# EAGLE design Seeeduino-stalker (EAGLE 5.10)
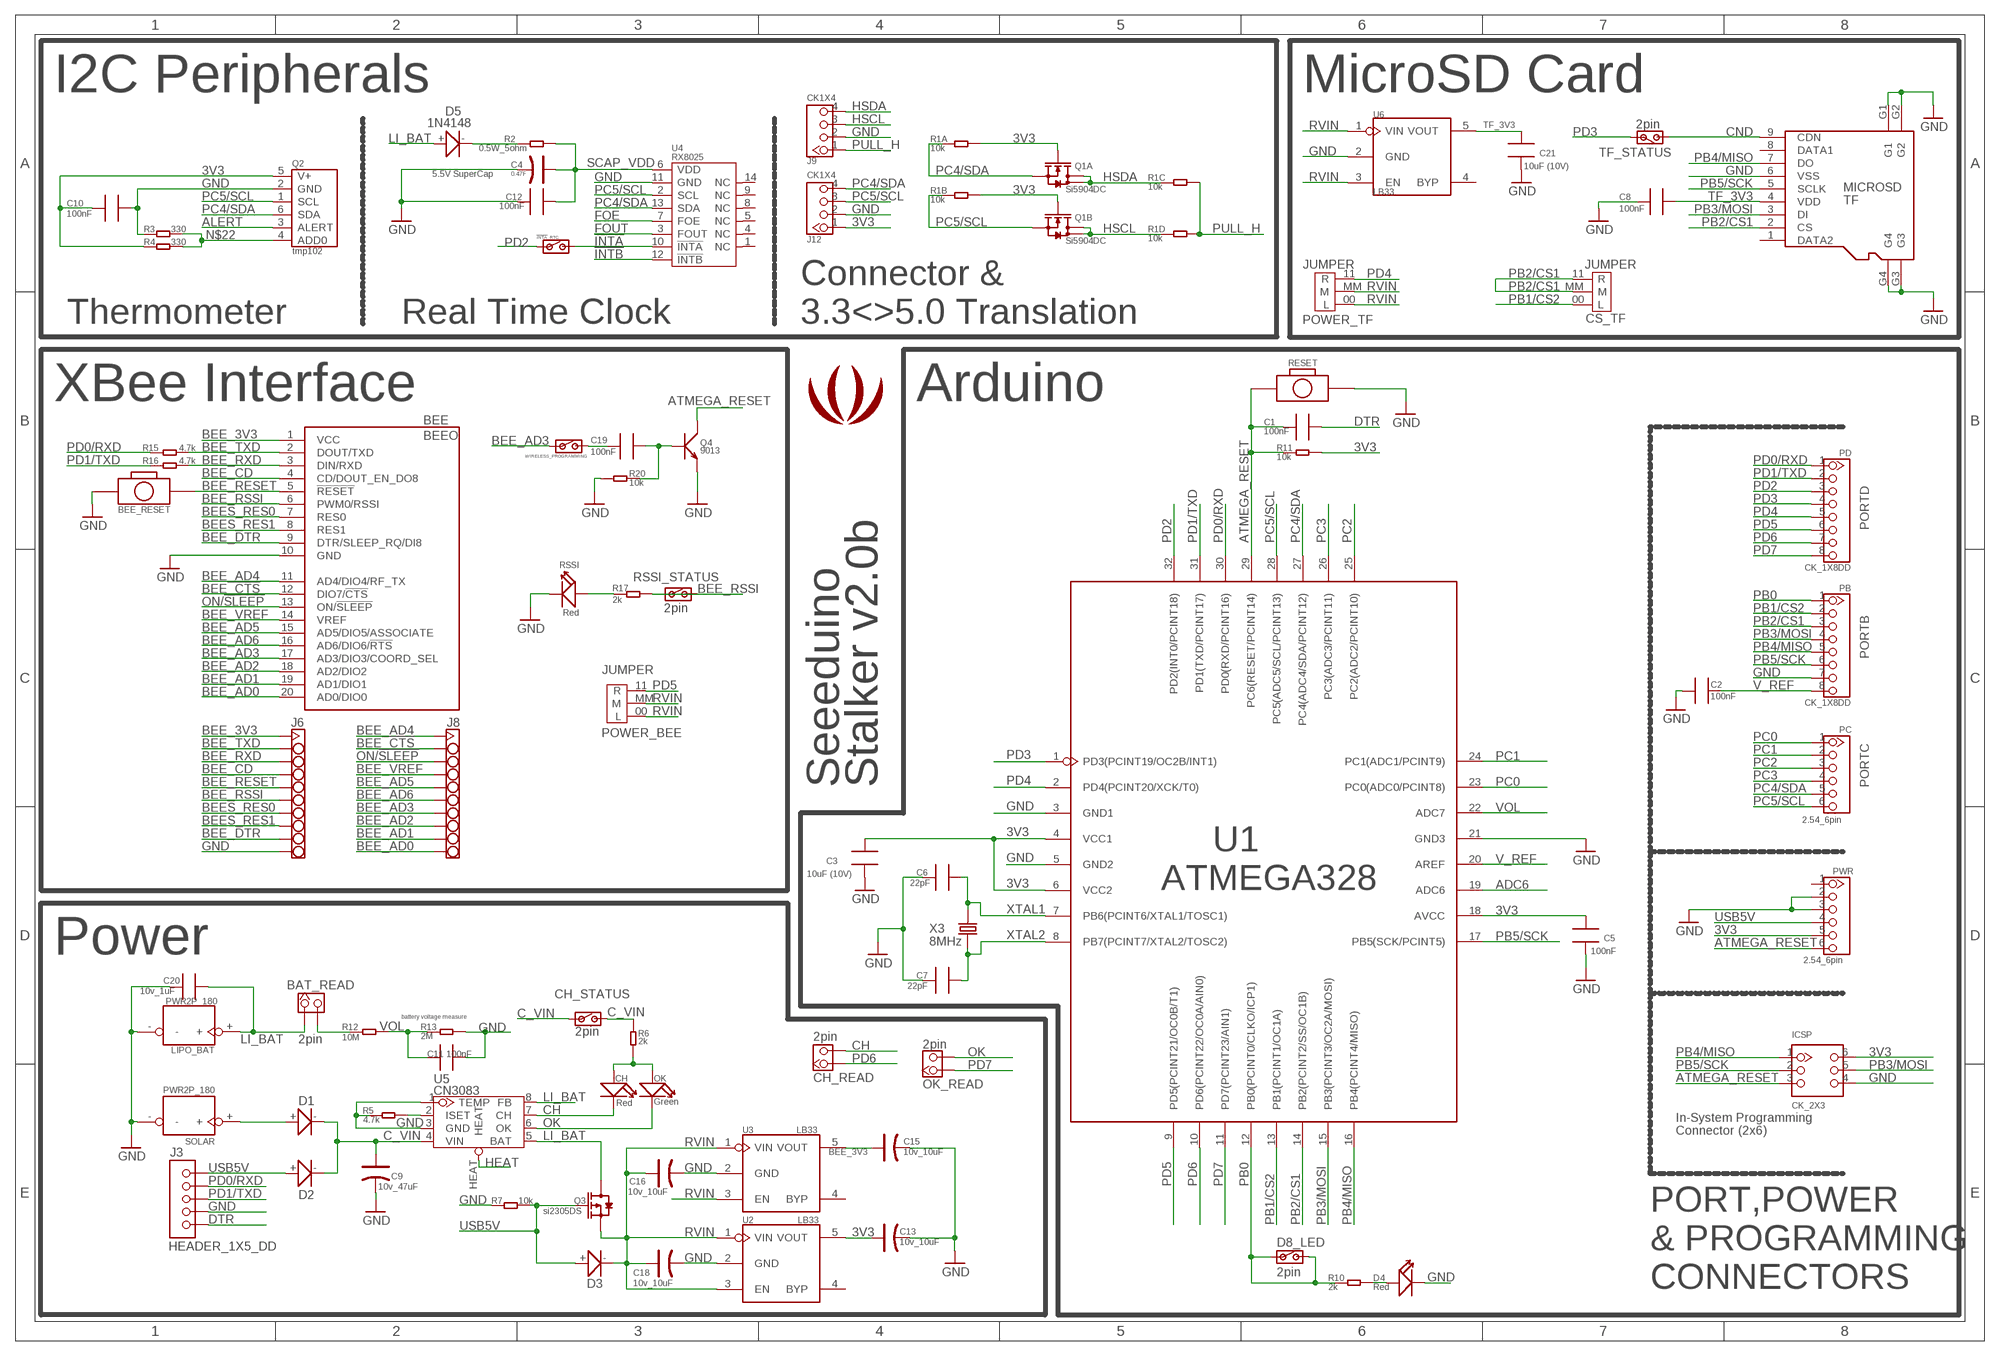
[diagram p0: schematic, sheet 1]

## Parts
!INTA!_RTC  JP_SW  [JP_SW]
BAT_READ  2pin  HEADER_1X2_2.54  [CK_1*2]
BEE  BEEO  [BEE]
BEE_RESET  BOTTON_1_SMD  [BOTTON_1]
C1  100nF  006-C0603  [0603]
C2  100nF  006-C0603  [0603]
C3  10uF (10V)  006-C0805  [0805]
C4  0.47F  006-CAP_UC13  [SUPER_CAP_R13]
C5  100nF  006-C0603  [0603]
C6  22pF  006-C0603  [0603]
C7  22pF  006-C0603  [0603]
C8  100nF  006-C0603  [0603]
C9  10v_47uF  006-CAP_AVX_B  [AVX_B]
C10  100nF  006-C0603  [0603]
C11  100nF  006-C0603  [0603]
C12  100nF  006-C0603  [0603]
C13  10v_10uF  006-CAP_AVX_B  [AVX_B]
C15  10v_10uF  006-CAP_AVX_B  [AVX_B]
C16  10v_10uF  006-CAP_AVX_B  [AVX_B]
C18  10v_10uF  006-CAP_AVX_B  [AVX_B]
C19  100nF  006-C0603  [0603]
C20  10v_1uF  006-C0805  [0805]
C21  10uF (10V)  006-C0805  [0805]
CH  Red  007-LED0603  [D0603]
CH_READ  2pin  HEADER_1X2_2.54  [CK_1*2]
CH_STATUS  2pin  JP_SW  [JP_SW]
CS_TF  JUMPER  [JUMPER]
D1  010-DMSS1P2U  [D1005]
D2  010-DMSS1P2U  [D1005]
D3  010-DMSS1P2U  [D1005]
D4  Red  007-LED0603  [D0603]
D5  1N4148  010-D1206  [D1206]
D8_LED  2pin  JP_SW  [JP_SW]
ICSP  CK_2X3  CK_2X3_DD  [CK_2X3]
J3  HEADER_1X5_DD  [CK_1X5]
J6  NULL  HEADER_1X10DD  [HEADER_1X10]
J8  null  HEADER_1X10DD  [HEADER_1X10]
J9  CK1X4  CK_1X4_DD  [CK_1X4]
J12  CK1X4  CK_1X4_DD  [CK_1X4]
LIPO_BAT  PWR2P_180  [PWR_1X2]
LOGO1  LOGO  [LOGO_RO]
OK  Green  007-LED0603  [D0603]
OK_READ  2pin  HEADER_1X2_2.54  [CK_1*2]
PB  CK_1X8DD  [CK_1X8]
PC  2.54_6pin  HEADER_1X6  [CK_1X6]
PD  CK_1X8DD  [CK_1X8]
POWER_BEE  JUMPER  [JUMPER]
POWER_TF  JUMPER  [JUMPER]
PWR  2.54_6pin  HEADER_1X6  [CK_1X6]
Q1  Si5904DC  010-DUAL-N-MOSFET_1206-8  [1206-8]
Q2  tmp102  TMP102  [SOT563]
Q3  si2305DS  010-P-MOSFETSOT23  [SOT23]
Q4  9013  010-NPNSOT23  [SOT23]
R1  10k  005-4R_1206  [R1206-8]
R2  0.5W_5ohm  005-R1206  [1206]
R3  330  005-R0603  [0603]
R4  330  005-R0603  [0603]
R5  4.7k  005-R0603  [0603]
R6  2k  005-R0603  [0603]
R7  10k  005-R0603  [0603]
R10  2k  005-R0603  [0603]
R11  10k  005-R0603  [0603]
R12  10M  005-R0603  [0603]
R13  2M  005-R0603  [0603]
R15  4.7k  005-R0603  [0603]
R16  4.7k  005-R0603  [0603]
R17  2k  005-R0603  [0603]
R20  10k  005-R0603  [0603]
RESET  BOTTON_1_DP  [BTN_5.0_RST]
RSSI  Red  007-LED0603  [D0603]
RSSI_STATUS  2pin  JP_SW  [JP_SW]
SOLAR  PWR2P_180  [PWR_1X2]
TF  MICROSD  [MICROSD]
TF_STATUS  2pin  JP_SW  [JP_SW]
U1  ATMEGA328  ATMEGA168-20AU  [ATMEGA168-20AU]
U2  LB33  MIC5025_X.X  [SOT23-5]
U3  LB33  MIC5025_X.X  [SOT23-5]
U4  RX8025  [SOP14]
U5  CN3083  [SOP8]
U6  LB33  MIC5025_X.X  [SOT23-5]
WIRELESS_PROGRAMMING  JP_SW  [JP_SW]
X3  8MHz  011-CRYSTALHC49S  [HC49/S]

## Nets
3V3: C3.2 C5.1 C10.1 C13.+ ICSP.6 J12.1 PWR.5 Q1.2(A:G) Q1.4(B:G) Q2.5(V+) R1.7 R1.8 R4.1 R11.2 U1.4(VCC1) U1.6(VCC2) U1.18(AVCC) U2.5(VOUT)
!INTA: !INTA!_RTC.2 U4.10(!INTA)
!INTB: U4.12(!INTB)
ADC6: U1.19(ADC6)
ALERT: Q2.3(ALERT)
ATMEGA_RESET: C1.1 ICSP.3 PWR.6 Q4.3(C) R11.1 RESET.P$1 U1.29(PC6(RESET/PCINT14))
BEE_3V3: BEE.1(VCC) C15.+ J6.1 U3.5(VOUT)
BEE_!CTS: BEE.12(DIO7/!CTS) J8.2
BEE_AD0: BEE.20(AD0/DIO0) J8.10
BEE_AD1: BEE.19(AD1/DIO1) J8.9
BEE_AD2: BEE.18(AD2/DIO2) J8.8
BEE_AD3: BEE.17(AD3/DIO3/COORD_SEL) J8.7 WIRELESS_PROGRAMMING.1
BEE_AD4: BEE.11(AD4/DIO4/RF_TX) J8.1
BEE_AD5: BEE.15(AD5/DIO5/ASSOCIATE) J8.5
BEE_AD6: BEE.16(AD6/DIO6/!RTS) J8.6
BEE_CD: BEE.4(CD/DOUT_EN_DO8) J6.4
BEE_DTR: BEE.9(DTR/SLEEP_RQ/DI8) J6.9
BEE_RESET: BEE.5(!RESET) BEE_RESET.P$2 J6.5
BEE_RSSI: BEE.6(PWM0/RSSI) J6.6 R17.2 RSSI_STATUS.1 RSSI_STATUS.2
BEE_RXD: BEE.3(DIN/RXD) J6.3 R16.2
BEE_TXD: BEE.2(DOUT/TXD) J6.2 R15.2
BEE_VREF: BEE.14(VREF) J8.4
BEES_RES0: BEE.7(RES0) J6.7
BEES_RES1: BEE.8(RES1) J6.8
C_VIN: C9.+ CH_STATUS.1 CH_STATUS.2 D1.- D2.- R6.2 U5.4(VIN)
CH: CH.- CH_READ.2 U5.7(CH)
CND: TF.9(CDN) TF_STATUS.2
DTR: C1.2 J3.5
FOE: U4.7(FOE)
FOUT: U4.3(FOUT)
GND: BEE.10(GND) BEE_RESET.1 C2.1 C3.1 C4.- C5.2 C6.1 C7.1 C8.2 C9.- C10.2 C11.2 C12.1 C13.- C15.- C16.- C18.- C20.1 C21.2 D4.- ICSP.4 J3.4 J6.10 J9.2 J12.2 LIPO_BAT.- PB.7 PWR.2 PWR.3 Q2.2(GND) Q4.2(E) R3.1 R5.1 R7.1 R13.2 R20.1 RESET.P$2 RSSI.- SOLAR.- TF.6(VSS) TF.G1 TF.G2 TF.G3 TF.G4 U1.3(GND1) U1.5(GND2) U1.21(GND3) U2.2(GND) U3.2(GND) U4.11(GND) U5.1(TEMP) U5.3(GND) U6.2(GND)
HEAT: U5.HEAT
HSCL: J9.3 Q1.5(B:D) Q1.6(B:D) R1.4
HSDA: J9.4 Q1.7(A:D) Q1.8(A:D) R1.3
LI_BAT: BAT_READ.1 C20.2 D5.+ LIPO_BAT.+ Q3.3(D) U5.5(BAT) U5.8(FB)
N$1: D4.+ R10.2
N$2: C19.1 WIRELESS_PROGRAMMING.2
N$3: D1.+ SOLAR.+
N$5: R5.2 U5.2(ISET)
N$6: R17.1 RSSI.+
N$8: CH.+ OK.+ R6.1
N$11: D5.- R2.1
N$15: BAT_READ.2 R12.1
N$20: C19.2 Q4.1(B) R20.2
N$22: Q2.4(ADD0) R3.2 R4.2
OK: OK.- OK_READ.2 U5.6(OK)
ON/!SLEEP: BEE.13(ON/!SLEEP) J8.3
PB0: D8_LED.1 D8_LED.2 PB.1 R10.1 U1.12(PB0(PCINT0/CLKO/ICP1))
PB1/CS2: CS_TF.00(L) PB.2 U1.13(PB1(PCINT1/OC1A))
PB2/CS1: CS_TF.11(R) CS_TF.MM(M) PB.3 TF.2(CS) U1.14(PB2(PCINT2/SS/OC1B))
PB3/MOSI: ICSP.5 PB.4 TF.3(DI) U1.15(PB3(PCINT3/OC2A/MOSI))
PB4/MISO: ICSP.1 PB.5 TF.7(DO) U1.16(PB4(PCINT4/MISO))
PB5/SCK: ICSP.2 PB.6 TF.5(SCLK) U1.17(PB5(SCK/PCINT5))
PC0: PC.1 U1.23(PC0(ADC0/PCINT8))
PC1: PC.2 U1.24(PC1(ADC1/PCINT9))
PC2: PC.3 U1.25(PC2(ADC2/PCINT10))
PC3: PC.4 U1.26(PC3(ADC3/PCINT11))
PC4/SDA: J12.4 PC.5 Q1.1(A:S) Q2.6(SDA) R1.1 U1.27(PC4(ADC4/SDA/PCINT12)) U4.13(SDA)
PC5/SCL: J12.3 PC.6 Q1.3(B:S) Q2.1(SCL) R1.2 U1.28(PC5(ADC5/SCL/PCINT13)) U4.2(SCL)
PD0/RXD: J3.2 PD.1 R15.1 U1.30(PD0(RXD/PCINT16))
PD1/TXD: J3.3 PD.2 R16.1 U1.31(PD1(TXD/PCINT17))
PD2: !INTA!_RTC.1 PD.3 U1.32(PD2(INT0/PCINT18))
PD3: PD.4 TF_STATUS.1 U1.1(PD3(PCINT19/OC2B/INT1))
PD4: PD.5 POWER_TF.11(R) U1.2(PD4(PCINT20/XCK/T0))
PD5: PD.6 POWER_BEE.11(R) U1.9(PD5(PCINT21/OC0B/T1))
PD6: CH_READ.1 PD.7 U1.10(PD6(PCINT22/OC0A/AIN0))
PD7: OK_READ.1 PD.8 U1.11(PD7(PCINT23/AIN1))
PULL_H: J9.1 R1.5 R1.6
RVIN: C16.+ C18.+ D3.- POWER_BEE.00(L) POWER_BEE.MM(M) POWER_TF.00(L) POWER_TF.MM(M) Q3.2(S) U2.1(VIN) U2.3(EN) U3.1(VIN) U3.3(EN) U6.1(VIN) U6.3(EN)
SCAP_VDD: C4.+ C12.2 R2.2 U4.6(VDD)
TF_3V3: C8.1 C21.1 TF.4(VDD) U6.5(VOUT)
USB5V: D2.+ D3.+ J3.1 PWR.4 Q3.1(G) R7.2
V_REF: C2.2 PB.8 U1.20(AREF)
VOL: C11.1 R12.2 R13.1 U1.22(ADC7)
XTAL1: C6.2 U1.7(PB6(PCINT6/XTAL1/TOSC1)) X3.2
XTAL2: C7.2 U1.8(PB7(PCINT7/XTAL2/TOSC2)) X3.1
Unconnected: PWR.1 TF.1(DATA2) TF.8(DATA1) U2.4(BYP) U3.4(BYP) U4.1(NC) U4.4(NC) U4.5(NC) U4.8(NC) U4.9(NC) U4.14(NC) U6.4(BYP)

## Notes on the sheet
- I2C Peripherals | MicroSD Card
- 5.5V SuperCap
- Connector &
- Thermometer | Real Time Clock | 3.3<>5.0 Translation
- XBee Interface | Arduino
- PORTD
- PORTB
- Seeeduino | Stalker v2.0b | PORTC
- Power
- battery voltage measure
- In-System Programming
- Connector (2x6)
- PORT,POWER
- & PROGRAMMING
- CONNECTORS

## Library data of the parts
!INTA!_RTC CH_STATUS D8_LED RSSI_STATUS TF_STATUS WIRELESS_PROGRAMMING = CPT_SMD:JP_SW
BAT_READ CH_READ OK_READ = CONNECTER:HEADER_1X2
BEE = EXT_moudle:BEE
BEE_RESET RESET = CPT_SMD:BOTTON_1
C1-C3 C5-C8 C10-C12 C19-C21 = Discrete:006-C*: Ceramic Capacitors
C4 C9 C13 C15 C16 C18 = Discrete:006-CAP*: Electrolytic Capacitors,Tantalum Capacitors and Super Capacitors
CH D4 OK RSSI = Discrete:007-LED*
CS_TF POWER_BEE POWER_TF = CPT_SMD:JUMPER
D1-D3 D5 = Discrete:010-D*
ICSP = CONNECTER:CK_2X3
J3 = CONNECTER:HEADER_1X5
J6 J8 = CONNECTER:HEADER_1X10
J9 J12 = CONNECTER:CK_1X4
LIPO_BAT SOLAR = CONNECTER:PWR2P
LOGO1 = logo:LOGO
PB PD = CONNECTER:CK_1X8
PC PWR = CONNECTER:HEADER_1X6
Q1 = Discrete:010-DUAL-N-MOSFET*: Si5902BDC Si5904DC Si5908DC Si5920DC
Q2 = ICs:TMP102: Low Power Digital Temperature Sensor With SMBus ? /Two-Wire Serial Interface in SOT563
Q3 = Discrete:010-P-MOSFET*: Si2305DS Si2323CDS
Q4 = Discrete:010-NPN*: NPN audion
R1 = Discrete:005-4R*: Resistor Array
R2-R7 R10-R13 R15-R17 R20 = Discrete:005-R*
TF = SD_TF_holder:MICROSD
U1 = IC_SMD:ATMEGA168-20AU
U2 U3 U6 = ICs_v54:MIC5025_X.X
U4 = ICs:RX8025: Real Time Clock Module -- build in 32.768kHz quartz oscillator
U5 = ICs_v54:CN3083
X3 = Discrete:011-CRYSTAL*: CRYSTAL

## Net classes
0 default: width 0.203 mm, drill 0.305 mm, clearance 0.152 mm

## Board
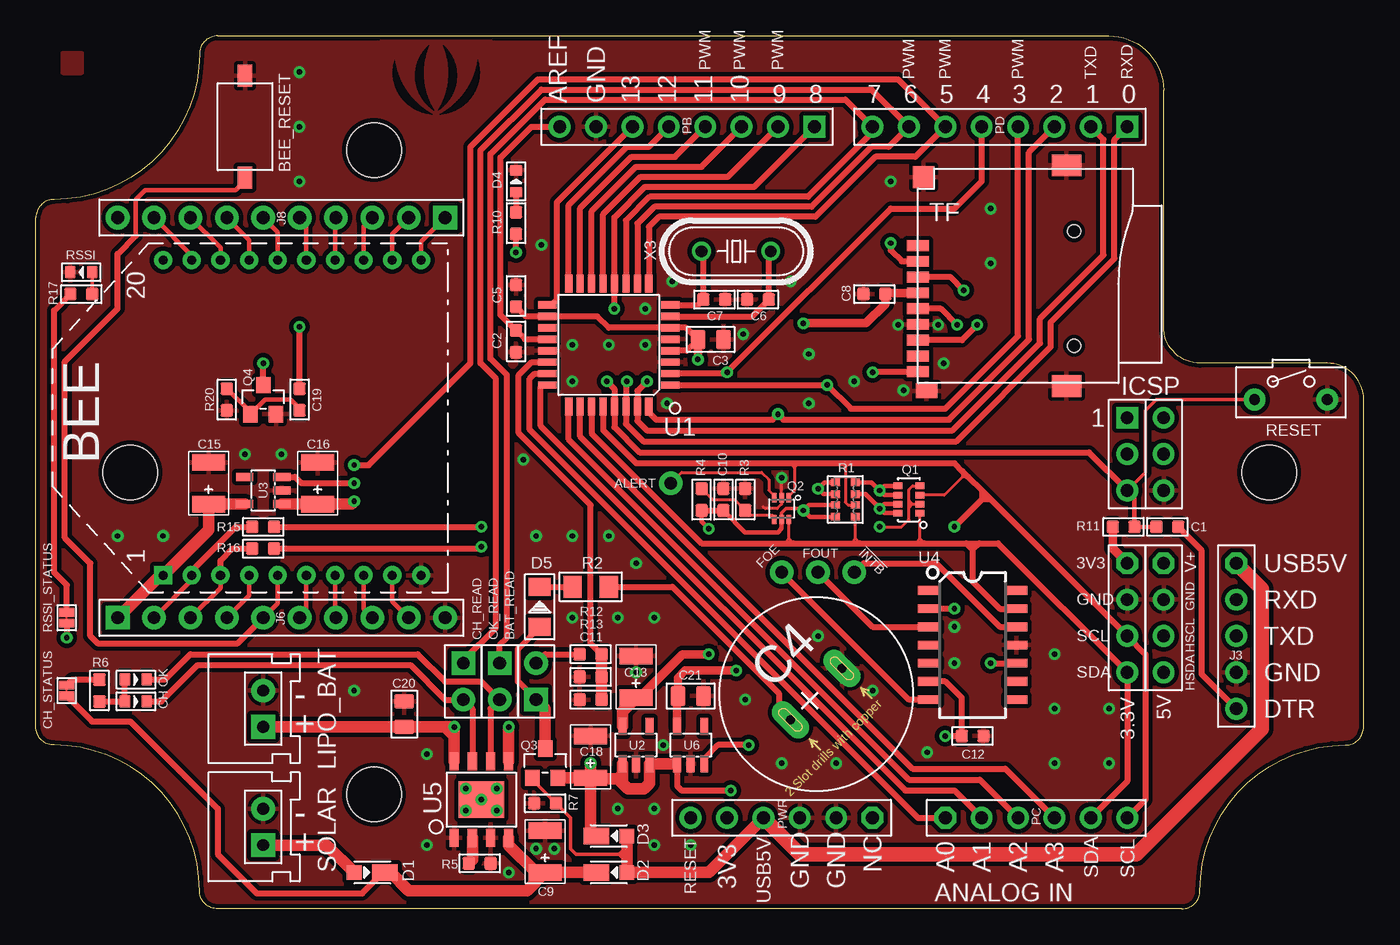
[diagram p1: board, top side]
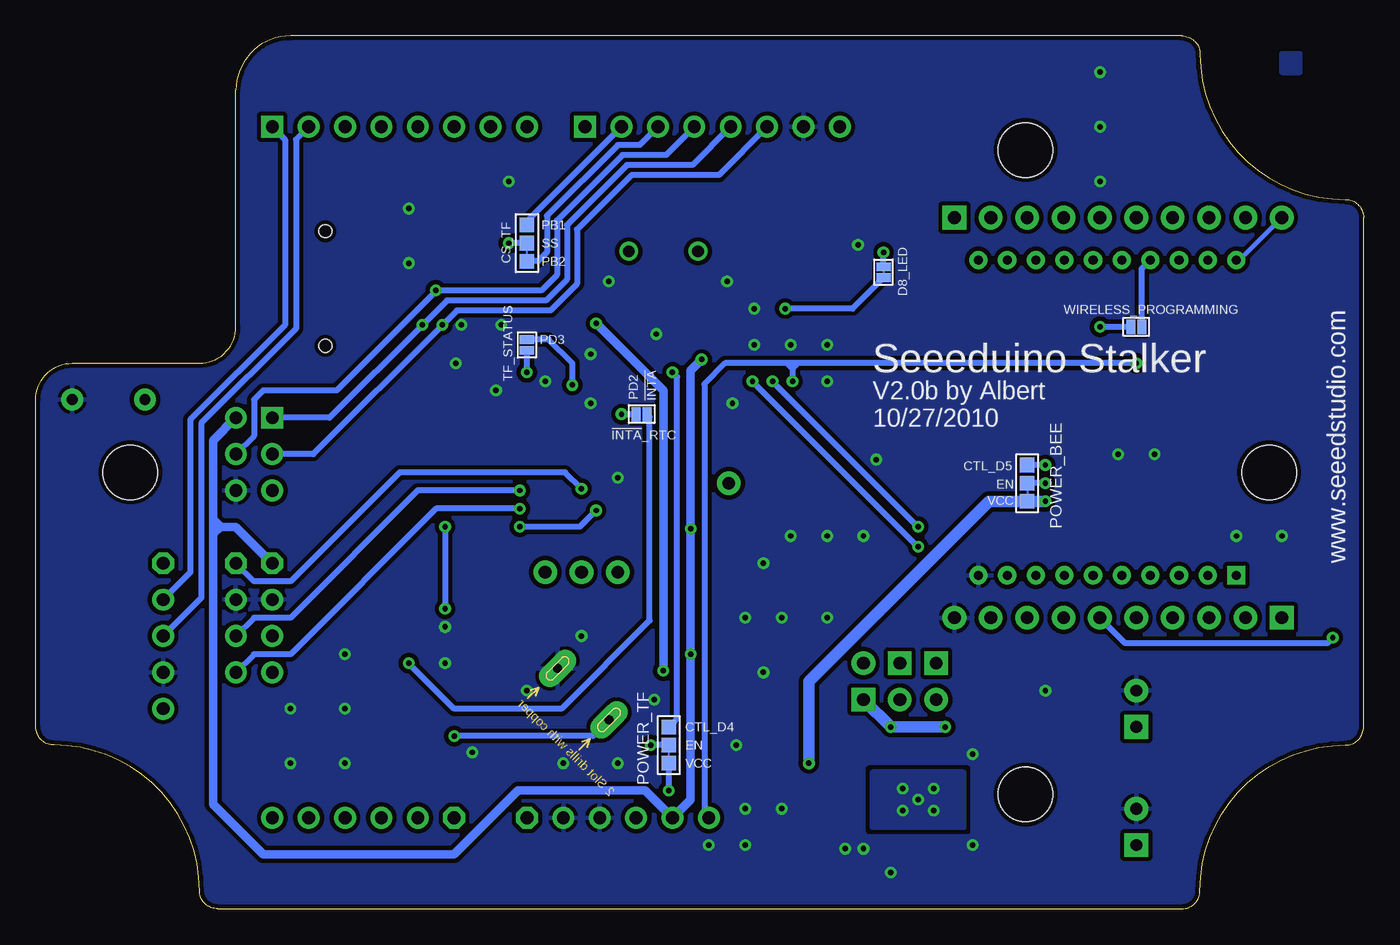
[diagram p2: board, bottom side, seen from below]

Size 92.71 x 60.96 mm. Coordinates in mm from the lower left corner, seen from the top.
Outline: 12.7,60.96 arc90 11.43,59.69 arc-90 1.27,49.53 arc90 0,48.26 0,12.7 arc90 1.27,11.43 arc-90 11.43,1.27 arc90 12.7,0 80.01,0 arc90 81.28,1.27 arc-90 91.44,11.43 arc90 92.71,12.7 92.71,35.56 arc90 90.17,38.1 81.28,38.1 arc-90 78.74,40.64 78.74,57.15 arc90 74.93,60.96 12.7,60.96
Copper layers (1*16): Top 0.035mm / dielectric 1.5mm / Bottom 0.035mm
Design rules "SeeedStudio_rule_no_angle_090911 *": minimum track width 6mil, minimum drill 12mil, track to track 6mil, track to pad 6mil, pad to pad 6mil, via to via 6mil, smd to smd 0mil, copper to edge 10mil, drill to drill 10mil, minimum pad ring 10mil, minimum via ring 6mil, stop-mask expansion 2mil, vias tented up to drill 25mil, thermal gap 10mil
Holes 3.81 mm at 23.61,52.98 86.11,30.48 6.61,30.48 23.61,7.98

### Footprints (pad centres in the part's own frame; a part is rotated, then mirrored left to right if it is on the bottom)
JP_SW = smd 1.016 x 0.61: 1 0,0.381; 2 0,-0.381
CK_1*2 = drill 0.889 pad 1.651 square: 1 0,1.27 | drill 0.889 pad 1.651 round: 2 0,-1.27
BEE = drill 0.635 pad 1.27 square: 1 -11,0 | drill 0.635 pad 1.27 round: 2 -11,-2; 3 -11,-4; 4 -11,-6; 5 -11,-8; 6 -11,-10; 7 -11,-12; 8 -11,-14; 9 -11,-16; 10 -11,-18; 11 11,-18; 12 11,-16; 13 11,-14; 14 11,-12; 15 11,-10; 16 11,-8; 17 11,-6; 18 11,-4; 19 11,-2; 20 11,0
BOTTON_1 = smd 1.524 x 1.016: 1 -3.556,0; P$2 3.556,0
0603 = smd 0.889 x 0.889: 1 -0.762,0; 2 0.762,0
0805 = smd 1.016 x 1.397: 1 -0.889,0; 2 0.889,0
SUPER_CAP_R13 = drill 0.635 pad 1.524 long: + -2.54,0; - 2.54,0
AVX_B = smd 1.143 x 2.286: + -1.46,0; - 1.46,0
D0603 = smd 0.762 x 0.889: + -0.762,0; - 0.762,0
JUMPER = smd 1.016 x 1.016: 00 -1.27,0; 11 1.27,0; MM 0,0
D1005 = smd 1.016 x 1.016: + 1.27,0 | smd 1.778 x 1.143: - -0.889,0
D1206 = smd 1.27 x 1.524: + -1.397,0; - 1.397,0
CK_2X3 = drill 0.889 pad 1.524 square: 1 -1.27,2.54 | drill 0.889 pad 1.524 round: 2 -1.27,0; 3 -1.27,-2.54; 4 1.27,-2.54; 5 1.27,0; 6 1.27,2.54
CK_1X5 = drill 0.889 pad 1.524 octagon: 1 0,5.08 | drill 0.889 pad 1.524 round: 2 0,2.54; 3 0,0; 4 0,-2.54; 5 0,-5.08
HEADER_1X10 = drill 0.889 pad 1.651 square: 1 0,11.43 | drill 0.889 pad 1.651 round: 2 0,8.89; 3 0,6.35; 4 0,3.81; 5 0,1.27; 6 0,-1.27; 7 0,-3.81; 8 0,-6.35; 9 0,-8.89; 10 0,-11.43
CK_1X4 = drill 0.889 pad 1.524 octagon: 1 0,3.81 | drill 0.889 pad 1.524 round: 2 0,1.27; 3 0,-1.27; 4 0,-3.81
PWR_1X2 = drill 0.813 pad 1.651 square: + 1.27,0 | drill 0.813 pad 1.651 round: - -1.27,0
CK_1X8 = drill 0.889 pad 1.524 square: 1 0,8.89 | drill 0.889 pad 1.524 round: 2 0,6.35; 3 0,3.81; 4 0,1.27; 5 0,-1.27; 6 0,-3.81; 7 0,-6.35; 8 0,-8.89
CK_1X6 = drill 0.889 pad 1.524 octagon: 1 0,6.35 | drill 0.889 pad 1.524 round: 2 0,3.81; 3 0,1.27; 4 0,-1.27; 5 0,-3.81; 6 0,-6.35
1206-8 = smd 0.457 x 0.635: 1 -0.953,-0.762; 2 -0.318,-0.762; 3 0.318,-0.762; 4 0.953,-0.762; 5 0.953,0.762; 6 0.318,0.762; 7 -0.318,0.762; 8 -0.953,0.762
SOT563 = smd 0.305 x 0.635: 1 -0.508,-0.762; 2 0,-0.762; 3 0.508,-0.762; 4 0.508,0.762; 5 0,0.762; 6 -0.508,0.762
SOT23 = smd 1.016 x 1.143: 1 -0.889,-1.016; 2 0.889,-1.016; 3 0,1.016
R1206-8 = smd 0.508 x 0.635: 1 -1.206,-0.699; 2 -0.381,-0.699; 3 0.381,-0.699; 4 1.206,-0.699; 5 1.206,0.699; 6 0.381,0.699; 7 -0.381,0.699; 8 -1.206,0.699
1206 = smd 1.27 x 1.524: 1 -1.27,0; 2 1.27,0
BTN_5.0_RST = drill 0.762 pad 1.524 round: P$1 0,2.54; P$2 0,-2.54
MICROSD = smd 1.524 x 0.762: 1 0,4.4; 2 0,3.3; 3 0,2.2; 4 0,1.1; 5 0,0; 6 0,-1.1; 7 0,-2.2; 8 0,-3.3; 9 0,-4.4 | smd 1.524 x 1.016: G1 0.6,-5.746 | smd 2.032 x 1.524: G2 10.373,-5.4; G3 10.373,10 | smd 1.524 x 1.524: G4 0.392,9.181 | hole 0.889: 10.9,-2.6; 10.9,5.4
ATMEGA168-20AU = smd 1.27 x 0.508: 1 -4.293,2.8; 2 -4.293,2; 3 -4.293,1.2; 4 -4.293,0.4; 5 -4.293,-0.4; 6 -4.293,-1.2; 7 -4.293,-2; 8 -4.293,-2.8; 17 4.293,-2.8; 18 4.293,-2; 19 4.293,-1.2; 20 4.293,-0.4; 21 4.293,0.4; 22 4.293,1.2; 23 4.293,2; 24 4.293,2.8 | smd 0.508 x 1.27: 9 -2.8,-4.293; 10 -2,-4.293; 11 -1.2,-4.293; 12 -0.4,-4.293; 13 0.4,-4.293; 14 1.2,-4.293; 15 2,-4.293; 16 2.8,-4.293; 25 2.8,4.293; 26 2,4.293; 27 1.2,4.293; 28 0.4,4.293; 29 -0.4,4.293; 30 -1.2,4.293; 31 -2,4.293; 32 -2.8,4.293
SOT23-5 = smd 0.55 x 1.2: 1 -0.95,-1.3; 2 0,-1.3; 3 0.95,-1.3; 4 0.95,1.3; 5 -0.95,1.3
SOP14 = smd 0.61 x 1.524: 1 -3.81,-3.048; 2 -2.54,-3.048; 3 -1.27,-3.048; 4 0,-3.048; 5 1.27,-3.048; 6 2.54,-3.048; 7 3.81,-3.048; 8 3.81,3.048; 9 2.54,3.048; 10 1.27,3.048; 11 0,3.048; 12 -1.27,3.048; 13 -2.54,3.048; 14 -3.81,3.048
SOP8 = smd 0.635 x 1.27: 1 -1.905,-2.667; 2 -0.635,-2.667; 3 0.635,-2.667; 4 1.905,-2.667; 5 1.905,2.667; 6 0.635,2.667; 7 -0.635,2.667; 8 -1.905,2.667 | smd 3.175 x 2.54: HEAT 0,0
HC49/S = drill 0.813 round: 1 -2.413,0; 2 2.413,0

### Placement (x,y rotation side)
!INTA!_RTC  50.42,34.54 90 bottom
BAT_READ  34.92,15.88 180 top
BEE  8.89,34.29 90 top
BEE_RESET  14.61,54.61 270 top
C1  78.99,26.67 0 top
C2  33.53,39.62 90 top
C3  47.12,39.75 180 top
C4  54.48,14.99 45 top
C5  33.53,42.8 90 top
C6  50.42,42.55 0 top
C7  47.37,42.55 180 top
C8  58.55,42.93 180 top
C9  35.56,4 90 top
C10  48.01,28.57 90 top
C11  38.73,14.61 180 top
C12  65.41,12.06 180 top
C13  41.91,16.19 90 top
C15  12.06,29.72 90 top
C16  19.68,29.72 90 top
C18  38.73,10.6 90 top
C19  18.41,35.56 270 top
C20  25.72,13.59 270 top
C21  45.72,14.86 0 top
CH  6.99,14.48 0 top
CH_READ  29.84,15.88 0 top
CH_STATUS  2.16,15.24 180 top
CS_TF  58.42,46.48 270 bottom
D1  23.5,2.54 180 top
D2  40.01,2.54 0 top
D3  40.01,5.08 0 top
D4  33.53,50.8 90 top
D5  35.18,21.08 90 top
D8_LED  33.53,44.45 180 bottom
ICSP  77.47,31.75 0 top
J3  83.82,19.05 0 top
J6  17.14,20.32 90 top
J8  17.14,48.26 270 top
J9  78.74,20.32 0 top
J12  76.2,20.32 0 top
LIPO_BAT  15.88,13.97 270 top
LOGO1  27.94,57.15 0 top
OK  6.99,16 0 top
OK_READ  32.38,15.88 0 top
PB  45.47,54.61 270 top
PC  69.85,6.35 90 top
PD  67.31,54.61 270 top
POWER_BEE  23.5,29.72 90 bottom
POWER_TF  48.51,11.43 90 bottom
PWR  52.07,6.35 270 top
Q1  60.96,28.57 90 top
Q2  52.07,27.94 180 top
Q3  35.56,10.16 0 top
Q4  15.88,35.56 0 top
R1  56.52,28.57 90 top
R2  38.73,22.48 0 top
R3  49.53,28.57 270 top
R4  46.48,28.57 90 top
R5  30.99,3.17 180 top
R6  4.45,15.24 90 top
R7  35.56,7.37 0 top
R10  33.53,47.88 90 top
R11  75.95,26.67 180 top
R12  38.73,17.78 0 top
R13  38.73,16.19 180 top
R15  15.88,26.67 180 top
R16  15.88,25.15 180 top
R17  3.17,42.93 180 top
R20  13.34,35.56 90 top
RESET  87.63,35.56 90 top
RSSI  3.17,44.45 180 top
RSSI_STATUS  2.16,20.32 0 top
SOLAR  15.88,5.71 270 top
TF  61.59,41.91 0 top
TF_STATUS  58.42,39.37 0 bottom
U1  40.01,39.37 180 top
U2  41.91,11.43 0 top
U3  15.88,29.21 90 top
U4  65.41,18.41 270 top
U5  31.11,7.62 0 top
U6  45.72,11.43 0 top
WIRELESS_PROGRAMMING  15.88,40.64 270 bottom
X3  48.9,45.91 0 top

### Tracks (layer width: path | path; a pad name or v marks a point on that pad's centre or on a via)
3V3  (via drill 0.38 pad 0.81)
  Top 0.203: Q1.4 61.21,29.53 60.96,29.27 60.96,28.51 | 61.21,28.26 60.96,28 | 61.21,28.26 Q1.2 | 60.96,28.51 61.21,28.26 | v58.93,26.67 60.45,26.67 60.96,27.18 60.96,28.26 | 60.96,28.26 60.96,28.51 | 60.96,28.26 61.21,28.26
  Top 0.254: Q2.5 52.07,27.62 52.39,27.94 53.47,27.94 v53.59,27.81
  Top 0.305: Q2.5 52.07,26.54 51.82,26.29 49.53,26.29 C10.1 | R1.7 53.98,28.19 v53.59,27.81 54.04,27.37 R1.8 | R4.1 46.48,27.05 v46.99,26.54
  Top 0.406: U1.4 45.45,38.97 C3.2 45.41,40.57 U1.6 40.01,40.57 39.21,41.37 U1.18 34.2,41.37 C5.1 | R4.1 C10.1
  Top 0.61: J12.1 75.18,25.15 R11.2 | v46.23,38.35 C3.2 | v46.99,17.78 45.15,17.78 42.1,14.73 C13.+
  Top 0.813: U2.5 40.96,13.78 C13.+
  Bottom 0.406: v58.93,26.67 54.74,26.67 v53.59,27.81
  Bottom 0.61: 80.33,27.18 80.33,32.7 ICSP.6 | v46.23,38.35 46.99,37.59 v46.99,26.54 v46.99,17.78 46.99,7.62 PWR.5 50.16,8.26 59.05,8.26 63.5,3.81 76.83,3.81 80.33,7.3 80.33,27.18 | J12.1 78.74,26.67 80.33,26.67 80.33,26.16 79.82,26.67 80.33,27.18
  pour Bottom: 4.45,59.69 5.71,59.69 5.71,58.42 4.45,58.42
!INTA  (via drill 0.38 pad 0.81)
  Top 0.406: v66.67,17.14 U4.10
  Bottom 0.406: !INTA!_RTC.2 49.85,34.35 49.85,20.13 56.01,13.97 63.5,13.97 v66.67,17.14
!INTB  (via drill 0.89 pad 1.65)
  Top 0.406: U4.12 67.31,19.68 62.87,24.13 57.78,24.13 v57.15,23.5
ALERT  (via drill 0.89 pad 1.65)
  Top 0.203: v44.32,29.72 45.09,30.48 50.67,30.48 51.18,29.97 51.18,29.21 51.56,28.83 Q2.3
ATMEGA_RESET  (via drill 0.38 pad 0.81)
  Top 0.254: RESET.P$1 78.23,35.56 77.47,34.8 77.47,30.48 ICSP.3
  Top 0.305: C1.1 R11.1 76.71,28.7 ICSP.3
  Top 0.406: Q4.3 v15.88,38.1 | v39.88,36.83 40.41,36.3 U1.29 40.41,33.64 42.16,31.88 73.53,31.88 ICSP.3
  Bottom 0.406: PWR.6 46.04,6.67 46.04,36.64 44.58,38.1 40.26,38.1 | 39.5,38.1 40.26,38.1 | v15.88,38.1 39.5,38.1 | 39.88,37.72 v39.88,36.83 | 39.5,38.1 39.88,37.72 | 40.26,38.1 39.88,37.72
BEE_3V3
  Top 0.813: U3.5 C15.+ 12.06,26.46 BEE.1 8.69,23.29 J6.1
BEE_!CTS
  Top 0.305: BEE.12 24.89,47.12 J8.2
BEE_AD0
  Bottom 0.305: BEE.20 8.69,45.29 J8.10
BEE_AD1
  Top 0.305: BEE.19 10.89,45.62 J8.9
BEE_AD2
  Top 0.305: BEE.18 12.89,46.16 J8.8
BEE_AD3
  Top 0.305: BEE.17 14.89,46.7 J8.7
  Bottom 0.406: WIRELESS_PROGRAMMING.1 15.49,44.69 BEE.17
BEE_AD4
  Top 0.305: BEE.11 26.89,46.58 J8.1
BEE_AD5
  Top 0.305: BEE.15 18.89,47.78 J8.5
BEE_AD6
  Top 0.305: BEE.16 16.89,47.24 J8.6
BEE_CD
  Top 0.305: BEE.4 14.89,21.88 J6.4
BEE_DTR
  Top 0.305: BEE.9 24.89,21.46 J6.9
BEE_RESET
  Top 0.305: BEE.5 16.89,21.34 J6.5 | 6.99,46.99 6.99,49.53 7.62,50.16 13.97,50.16 14.61,50.8 BEE_RESET.P$2
  Top 0.406: J6.5 14.1,18.54 4.32,18.54 3.81,19.05 3.81,24.13 2.03,25.91 2.03,38.23 5.71,41.91 5.71,45.72 6.99,46.99
BEE_RSSI  (via drill 0.38 pad 0.81)
  Top 0.152: RSSI_STATUS.2 RSSI_STATUS.1
  Top 0.305: BEE.6 18.89,20.8 J6.6
  Top 0.406: R17.2 1.27,41.78 1.27,23.5 2.16,22.61 RSSI_STATUS.1 | RSSI_STATUS.2 v2.16,18.92
  Bottom 0.406: J6.6 16.64,18.54 2.54,18.54 v2.16,18.92
BEE_RXD
  Top 0.305: BEE.3 12.89,22.41 J6.3
  Top 0.406: BEE.3 12.89,24.32 13.72,25.15 R16.2
BEE_TXD
  Top 0.305: BEE.2 10.89,22.95 J6.2
  Top 0.406: BEE.2 10.89,23.59 13.97,26.67 R15.2
BEE_VREF
  Top 0.305: BEE.14 20.89,48.2 J8.4
BEES_RES0
  Top 0.305: BEE.7 20.89,20.39 J6.7
BEES_RES1
  Top 0.305: BEE.8 22.89,20.93 J6.8
C_VIN
  Top 0.152: CH_STATUS.1 CH_STATUS.2
  Top 0.406: D1.- 24.26,2.54 22.8,1.08 15.43,1.08 12.7,3.81 12.7,6.99 6.6,13.08 3.94,13.08 CH_STATUS.1 | R6.2 2.54,16 CH_STATUS.2
  Top 0.813: C9.+ 34.29,1.27 26.04,1.27 24.77,2.54 D1.- | C9.+ 34.92,2.54 33.02,4.45 U5.4 | C9.+ D2.-
CH
  Top 0.406: CH.- 8.76,14.48 11.3,17.02 26.16,17.02 28.57,14.61 CH_READ.2 30.48,13.97 U5.7
CND  (via drill 0.38 pad 0.81)
  Top 0.406: TF.9 58.47,37.51 v58.42,37.47
  Bottom 0.406: v58.42,37.47 TF_STATUS.2
DTR
  Top 0.406: J3.5 81.41,16.38 81.41,25.02 C1.2
FOE  (via drill 0.89 pad 1.65)
  Top 0.406: U4.7 60.96,14.61 v52.07,23.5
FOUT  (via drill 0.89 pad 1.65)
  Top 0.406: U4.3 58.42,19.68 v54.61,23.5
GND  (via drill 0.38 pad 0.81)
  Top 0.203: v52.07,30.1 Q2.2 52.07,28.26 51.75,27.94 50.93,27.94 50.8,28.07
  other vias: 40.01,39.37 37.47,39.37 42.55,39.37 42.55,41.91 62.99,40.77 60.58,36.2 63.37,38.1 36.2,4.19 34.92,4.19 22.23,15.24 33.02,2.54 45.72,4.45 43.18,4.45 35.31,46.35 60.2,40.77 43.18,6.99 5.71,26.04 8.89,26.04 17.14,31.75 14.61,31.75 43.81,11.43 41.91,16.51 18.41,50.8 18.41,54.61 18.41,58.42 49.4,40.13 53.98,38.73 59.69,50.8 44.45,43.81 52.7,43.81 57.15,36.83 66.67,45.09 66.67,48.9 58.42,15.24 54.61,19.05 64.14,19.68 64.14,17.14 71.12,17.78 71.12,13.97 74.93,10.16 71.12,10.16 74.93,13.97 37.47,36.83 27.3,10.79 27.3,4.45 40.64,6.99 40.64,20.32 43.18,20.32 40.01,26.04 41.91,24.13 37.47,26.04 34.92,26.04 37.47,20.32 34.04,31.37 44.07,35.31 53.98,35.31 62.23,10.92 55.88,10.16 52.07,10.16 49.53,14.61
  pour Top (rank 6): 3.17,59.69 1.91,59.69 1.91,58.42 3.17,58.42
  pour Top (rank 6, no thermals): 24.13,60.96 31.75,60.96 31.75,56.52 29.84,54.61 26.04,54.61 24.13,56.52
  pour Top (isolate 0.305, rank 6): 0,60.96 92.71,60.96 92.71,0 0,0
  pour Bottom (isolate 0.305, rank 6): 0,60.96 92.71,60.96 92.71,0 0,0
HEAT  (via drill 0.38 pad 0.81)
  other vias: 30.04,8.38 30.04,6.86 32.19,6.86 32.19,8.38 31.11,7.62
  pour Bottom (isolate 0.254): 27.94,9.53 34.29,9.53 34.29,5.71 27.94,5.71
HSCL  (via drill 0.38 pad 0.81)
  Top 0.305: Q1.6 59.24,28.89 v58.93,29.21 | Q1.5 59.24,29.53 v58.93,29.21 | R1.4 58.36,29.78 v58.93,29.21
  Bottom 0.406: J9.3 77.47,20.32 74.93,20.32 66.04,29.21 v58.93,29.21
HSDA  (via drill 0.38 pad 0.81)
  Top 0.305: Q1.8 59.24,27.62 v58.93,27.94 | Q1.7 59.24,28.26 v58.93,27.94 | R1.3 57.91,28.96 v58.93,27.94
  Bottom 0.406: J9.4 77.47,17.78 74.93,17.78 64.77,27.94 v58.93,27.94
LI_BAT  (via drill 0.38 pad 0.81)
  Top 0.406: BAT_READ.1 33.66,15.88 33.66,18.16 D5.+
  Top 0.813: LIPO_BAT.+ C20.2 v29.21,12.7 | v33.02,12.7 U5.5 | Q3.3 35.56,13.97 BAT_READ.1 | v29.21,12.7 28.57,12.7 29.21,12.06 v29.21,12.7 | v29.21,12.7 U5.8
  Bottom 0.813: v29.21,12.7 v33.02,12.7 BAT_READ.1
N$1
  Top 0.406: D4.+ R10.2
N$2  (via drill 0.38 pad 0.81)
  Top 0.406: C19.1 v18.41,40.64
  Bottom 0.406: v18.41,40.64 WIRELESS_PROGRAMMING.2
N$3
  Top 0.813: SOLAR.+ 20.32,4.45 D1.+
N$5
  Top 0.813: U5.2 30.48,3.43 R5.2
N$6
  Top 0.254: R17.1 RSSI.+
N$8
  Top 0.406: R6.1 CH.+ OK.+
N$11
  Top 0.406: D5.- R2.1
N$15
  Top 0.406: R12.1 35.56,17.78 BAT_READ.2
N$20
  Top 0.305: C19.2 18.41,34.92 17.78,35.56 16,35.56 Q4.1 14.99,34.67 R20.2
N$22
  Top 0.203: Q2.4 51.56,27.37 51.44,27.5 49.85,27.5 R3.2 48.77,28.57 47.24,28.57 R4.2
OK
  Top 0.406: OK.- 9.02,16 10.79,17.78 26.67,17.78 28.57,15.88 31.11,15.88 OK_READ.2 31.75,13.97 U5.6
ON/!SLEEP
  Top 0.305: BEE.13 22.89,47.66 J8.3
PB0  (via drill 0.38 pad 0.81)
  Top 0.406: PB.1 50.16,50.42 42.55,50.42 40.41,48.28 U1.12 40.41,41.93 v40.39,41.91 | v33.53,45.85 R10.1
  Bottom 0.152: D8_LED.2 D8_LED.1
  Bottom 0.406: D8_LED.2 v33.53,45.85 | v40.39,41.91 35.69,41.91 D8_LED.1
PB1/CS2
  Top 0.406: U1.13 39.6,48.49 42.23,51.12 48.32,51.12 PB.2
  Bottom 0.406: PB.2 58.42,48.01 CS_TF.00
PB2/CS1  (via drill 0.38 pad 0.81)
  Top 0.406: U1.14 38.8,48.71 41.91,51.82 46.48,51.82 PB.3 | TF.2 60.45,45.21 59.69,45.97 v59.69,46.48
  Bottom 0.152: CS_TF.11 CS_TF.MM
  Bottom 0.406: PB.3 50.55,53.34 52.07,53.34 57.02,48.39 57.02,45.85 57.66,45.21 CS_TF.11 | CS_TF.MM v59.69,46.48
PB3/MOSI  (via drill 0.38 pad 0.81)
  Top 0.406: U1.15 38.01,48.93 41.59,52.51 44.64,52.51 PB.4 | TF.3 63.84,44.11 v64.77,43.18
  Bottom 0.406: ICSP.5 77.47,33.02 77.47,35.56 76.83,36.2 71.69,36.2 64.77,43.12 v64.77,43.18 57.4,43.18 56.33,44.26 56.33,48.07 51.75,52.64 48.7,52.64 PB.4
PB4/MISO  (via drill 0.38 pad 0.81)
  Top 0.406: U1.16 37.2,49.14 41.27,53.21 42.8,53.21 PB.5 | TF.7 64.67,39.71 v65.72,40.77
  Bottom 0.406: ICSP.1 72.2,34.29 v65.72,40.77 64.01,42.48 57.09,42.48 55.63,43.94 55.63,47.75 51.44,51.94 46.86,51.94 PB.5
PB5/SCK  (via drill 0.38 pad 0.81)
  Top 0.406: U1.17 36.01,42.17 36.39,42.55 36.39,49.34 PB.6 | TF.5 63.18,41.91 v64.33,40.77
  Bottom 0.406: PB.6 45.02,51.24 51.12,51.24 54.93,47.43 54.93,43.62 56.77,41.78 63.31,41.78 v64.33,40.77 73.34,31.75 ICSP.2
PC0
  Top 0.406: U1.23 34.83,37.37 34.48,37.02 34.48,33.47 61.59,6.35 PC.1
PC1
  Top 0.406: U1.24 35.36,36.57 35.24,36.45 35.24,33.72 60.71,8.26 64.14,8.26 PC.2
PC2
  Top 0.406: U1.25 37.2,32.77 60.96,9.02 65.91,9.02 PC.3
PC3
  Top 0.406: U1.26 38.01,32.99 61.21,9.78 67.69,9.78 PC.4
PC4/SDA
  Top 0.203: 52.58,25.84 Q2.6 | 52.58,25.84 52.26,25.53 | 52.9,25.53 52.58,25.84 | 57.21,25.84 R1.1 | 57.21,25.84 56.9,25.53 | 57.53,25.53 57.21,25.84 | 61.72,25.84 Q1.1 | 61.72,25.84 61.4,25.53 | 62.04,25.53 61.72,25.84
  Top 0.406: PC.5 76.2,8.89 J12.4 67.18,25.53 65.85,25.53 | U1.27 38.8,33.2 46.48,25.53 52.9,25.53 57.53,25.53 62.04,25.53 64.96,25.53 | 64.96,25.53 65.85,25.53 | U4.13 67.31,20.95 65.41,22.86 65.41,25.08 | 64.96,25.53 65.41,25.08 | 65.85,25.53 65.41,25.08
PC5/SCL  (via drill 0.38 pad 0.81)
  Top 0.203: 52.96,30.8 52.64,31.11 | 53.28,31.11 52.96,30.8 | 52.96,30.8 52.96,29.21 52.58,28.83 Q2.1 | R1.2 56.71,28.19 56.52,28.38 56.52,30.86 | 56.52,30.86 56.26,31.11 | 56.77,31.11 56.52,30.86 | Q1.3 63.44,28.89 64.71,30.16 | 64.71,30.54 64.71,30.16 | 65.09,30.16 64.71,30.16
  Top 0.406: U1.28 39.6,33.42 41.91,31.11 53.28,31.11 56.77,31.11 64.14,31.11 64.71,30.54 65.09,30.16 66.04,29.21 | PC.6 77.47,7.62 77.47,17.78 J12.3 66.67,28.57 | 66.04,29.21 66.67,28.57 | v64.14,20.95 U4.2 | 66.04,28.57 v64.14,26.67 | 66.04,29.21 66.04,28.57 | 66.67,28.57 66.04,28.57
  Bottom 0.406: v64.14,26.67 v64.14,20.95
PD0/RXD  (via drill 0.38 pad 0.81)
  Top 0.406: PD.1 75.31,53.72 75.31,45.4 70.87,40.96 70.87,39.24 64.26,32.64 42.42,32.64 41.2,33.85 U1.30 41.2,36.76 v41.27,36.83 | R15.1 v31.11,26.67
  Bottom 0.406: PD.1 75.31,53.72 75.31,40.77 81.92,34.16 81.92,23.5 J3.2 | v31.11,26.67 v41.27,36.83
PD1/TXD  (via drill 0.38 pad 0.81)
  Top 0.406: PD.2 74.55,53.72 74.55,45.66 70.1,41.21 70.1,39.5 64.01,33.4 42.67,33.4 42.01,34.07 U1.31 42.01,36.16 v42.67,36.83 | R16.1 30.99,25.15 v31.11,25.27
  Bottom 0.406: PD.2 74.55,53.72 74.55,40.51 81.15,33.91 81.15,21.72 J3.3 | v31.11,25.27 v42.67,36.83
PD2  (via drill 0.38 pad 0.81)
  Top 0.406: PD.3 69.34,52.83 69.34,39.75 63.75,34.16 52.2,34.16 v51.82,34.54 51.44,34.16 43.31,34.16 42.8,34.66 U1.32
  Bottom 0.406: v51.82,34.54 !INTA!_RTC.1
PD3  (via drill 0.38 pad 0.81)
  Top 0.406: PD.4 68.58,40.01 63.5,34.92 56.9,34.92 v55.24,36.58 v55.24,36.57 U1.1
  Bottom 0.406: TF_STATUS.1 56.9,39.75 55.24,38.1 v55.24,36.58
PD4  (via drill 0.38 pad 0.81)
  Top 0.406: PD.5 66.04,50.8 64.14,48.9 59.69,48.9 v48.26,37.47 48.16,37.37 U1.2
  Bottom 0.406: 48.26,12.95 POWER_TF.11 47.94,13.27 47.94,37.15 v48.26,37.47
PD5  (via drill 0.38 pad 0.81)
  Top 0.406: U1.9 42.8,47.63 43.5,48.32 54.42,48.32 58.61,52.51 61.4,52.51 PD.6 60.2,57.91 35.05,57.91 30.35,53.21 30.35,38.1 23.24,30.99 v22.23,30.99
  Bottom 0.406: v22.23,30.99 POWER_BEE.11
PD6
  Top 0.406: U1.10 42.01,47.85 43.18,49.02 54.17,49.02 58.36,53.21 59.56,53.21 PD.7 58.36,57.21 35.31,57.21 31.05,52.96 31.05,38.1 32.13,37.02 32.13,19.62 29.84,17.34 CH_READ.1
PD7
  Top 0.406: U1.11 41.2,48.06 42.86,49.72 53.91,49.72 58.42,54.23 PD.8 56.52,56.52 35.56,56.52 31.75,52.7 31.75,38.42 32.89,37.27 32.89,18.92 32.38,18.41 OK_READ.1
PULL_H  (via drill 0.38 pad 0.81)
  Top 0.305: R1.5 55.05,29.78 v54.61,29.34 54.99,28.96 R1.6
  Bottom 0.406: J9.1 77.47,22.86 74.93,22.86 67.31,30.48 55.75,30.48 v54.61,29.34
RVIN  (via drill 0.38 pad 0.81)
  Top 0.406: U3.3 18.1,30.16 18.54,29.72 v22.23,29.72 | v48.51,8.26 45.09,8.26 44.77,8.57 U6.1 | U6.3 46.67,10.47 47.62,11.43 v49.78,11.43
  Top 0.61: 44.67,10.13 U6.1
  Top 0.813: v38.73,10.16 C18.+ 38.73,9.08 | D3.- 38.73,5.08 38.73,8.89 | 38.73,9.08 38.73,8.89 | C16.+ U3.1 | C16.+ | Q3.2 38.48,9.14 38.73,8.89 | C16.+ 22.04,28.26 v22.23,28.45 | 44.67,10.13 U2.3 42.86,8.76 42.48,8.38 41.34,8.38 40.96,8.76 U2.1 40.96,9.4 40.7,9.14 | 38.73,9.08 40.64,9.08 40.7,9.14 | 40.7,9.14 40.7,9.02 40.96,8.76
  Bottom 0.152: POWER_BEE.MM POWER_BEE.00 | POWER_TF.00 POWER_TF.MM
  Bottom 0.406: v22.23,29.72 POWER_BEE.MM | v48.51,8.26 POWER_TF.00 | POWER_TF.MM v49.78,11.43
  Bottom 0.813: v38.73,10.16 38.73,15.88 26.16,28.45 POWER_BEE.00 v22.23,28.45
SCAP_VDD  (via drill 0.38 pad 0.81)
  Top 0.406: C4.+ 51.88,14 51.88,15.05 44.45,22.48 R2.2 | v63.5,12.06 C12.2 64.64,14.73 63.5,15.88 U4.6
  Bottom 0.406: C4.+ 53.81,12.06 v63.5,12.06
TF_3V3  (via drill 0.38 pad 0.81)
  Top 0.61: U6.5 44.77,14.8 C21.1 44.83,16.13 45.34,16.64 v48.9,16.64 | TF.4 59.39,43.01 C8.1 59.31,42.23 57.98,40.89 v53.59,40.89
  Bottom 0.61: v48.9,16.64 48.9,36.2 v53.59,40.89
USB5V
  Top 0.254: Q3.1 34.67,9.02 R7.2 37.34,6.35 37.34,4.19 37.72,3.81 40.7,3.81 | 40.7,3.81 41.27,4.38 | 40.7,3.81 41.27,3.81 | 40.7,3.81 41.27,3.24
  Top 0.813: PWR.4 46.99,2.54 D2.+ 41.27,3.81 D3.+
  Top 1.016: PWR.4 53.34,3.81 76.83,3.81 85.6,12.57 85.6,22.35 J3.1
V_REF
  Top 0.406: PB.8 34.61,54.61 32.45,52.45 32.45,41.47 C2.2 34.14,39.77 U1.20
VOL
  Top 0.406: U1.22 34.61,38.17 33.72,37.27 33.72,33.21 38.73,28.19 38.73,18.54 R12.2
  Top 0.813: R12.2 R13.1 C11.1
XTAL1
  Top 0.406: U1.7 50.01,41.37 C6.2 51.18,45.78 X3.2
XTAL2
  Top 0.406: U1.8 46.23,42.17 C7.2 46.61,45.78 X3.1

### Text on the board
tPlace: PWM | PWM | PWM | PWM | PWM | PWM | TXD | RXD | AREF | GND | 13 | 12 | 11 | 10 | 9 | 8 | 7 | 6 | 5 | 4 | 3 | 2 | 1 | 0 | 1 | ALERT | FOUT | !INTB | FOE | 3V3 | V+ | USB5V | GND | GND | RXD | SCL | HSCL | TXD | SDA | GND | HSDA | - | 5V | DTR | + | 3.3V | - | + | NC | A0 | A1 | A2 | A3 | SDA | SCL | RESET | 3V3 | GND | GND | ANALOG IN | USB5V
bPlace: PB1 | SS | PB2 | PD3 | Seeeduino Stalker | V2.0b by Albert | PD2 | !INTA | 10/27/2010 | CTL_D5 | EN | VCC | www.seeedstudio.com | CTL_D4 | EN | VCC